# Altium schematic sheet A3010_Adelaide_Keyboard.SchDoc: ARM2 to ARM3 Adapter
size A3; DocumentNumber: 1; SheetNumber: 2; SheetTotal: 5
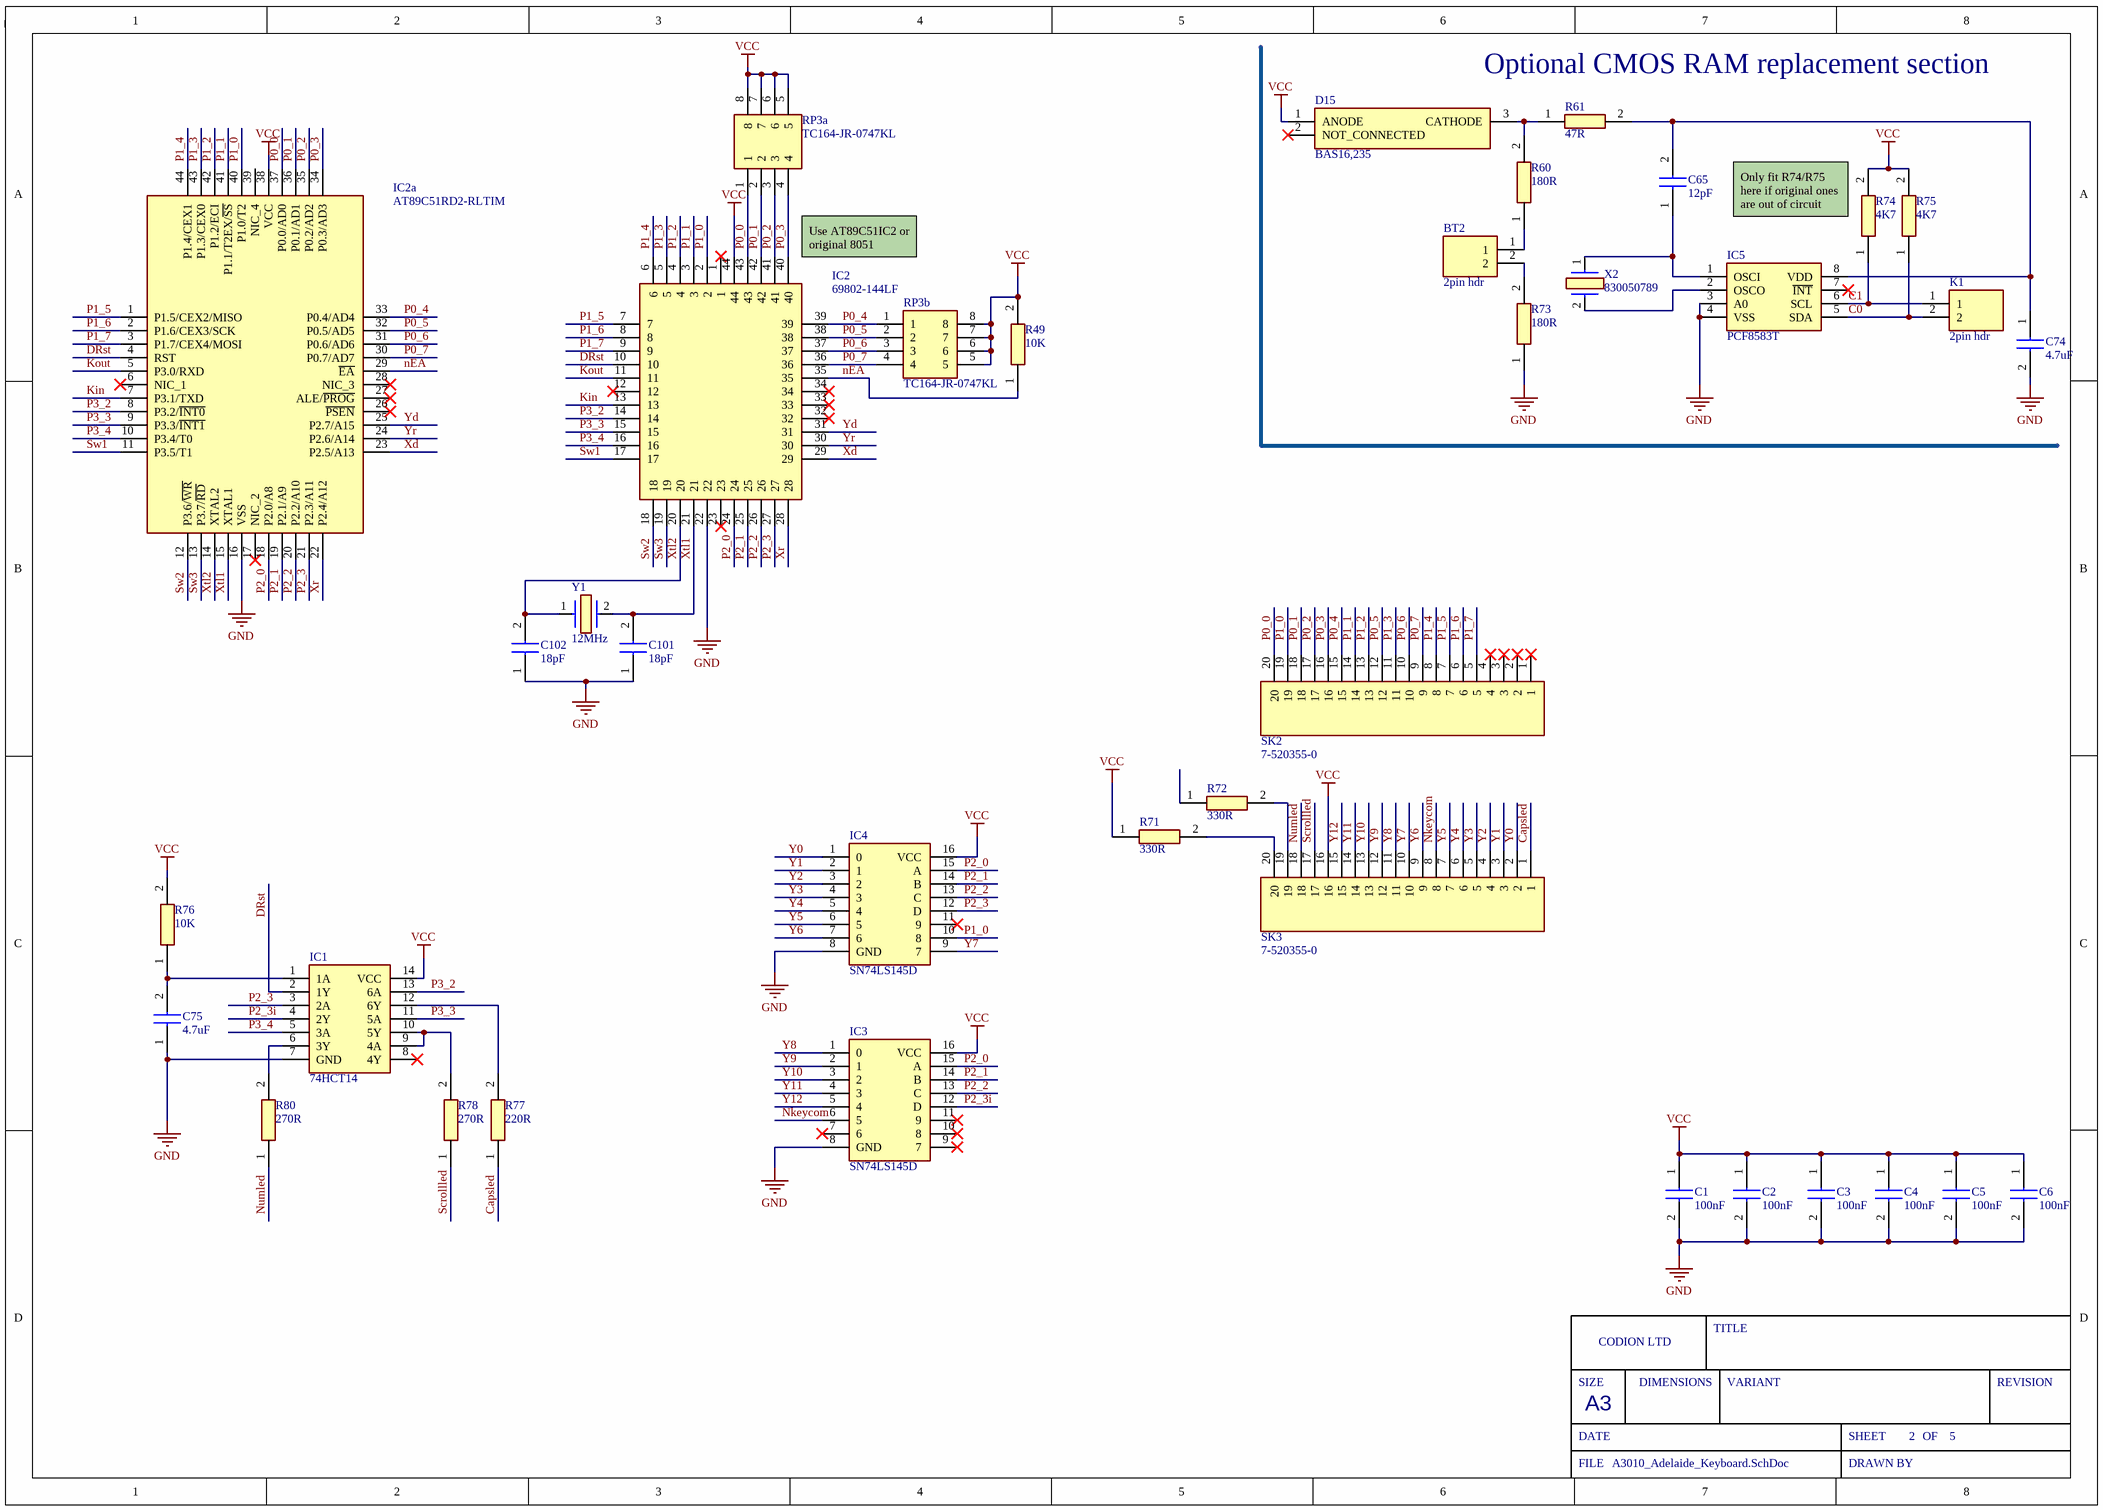
[diagram p0: A3010_Adelaide_Keyboard.SchDoc]

## Parts
BT2  2pin hdr  [10129378902002BLF]
C1  100nF  [0805cap]
C2  100nF  [0805cap]
C3  100nF  [0805cap]
C4  100nF  [0805cap]
C5  100nF  [0805cap]
C6  100nF  [0805cap]
C65  12pF  [CAPC1608X90N]
C74  4.7uF  [0805cap]
C75  4.7uF  [0805cap]
C101  18pF  [CAPC1608X87N]
C102  18pF  [CAPC1608X87N]
D15  BAS16,235  [SOT95P230X110-3N]
IC1  74HCT14  [SOIC127P600X175-14N]
IC2  69802-144LF  [69802144LF]
IC2a  AT89C51RD2-RLTIM  [QFP80P1200X1200X160-44N]
IC3  SN74LS145D  [SOIC127P600X175-16N]
IC4  SN74LS145D  [SOIC127P600X175-16N]
IC5  PCF8583T  [SOIC127P1032X265-8N]
K1  2pin hdr  [10129378902002BLF]
R49  10K  [RESC1005X40N]
R60  180R  [RESC1005X40N]
R61  47R  [RESC1005X40N]
R71  330R  [RESC1005X40N]
R72  330R  [RESC1005X40N]
R73  180R  [RESC1005X40N]
R74  4K7  [RESC1005X40N]
R75  4K7  [RESC1005X40N]
R76  10K  [RESC1005X40N]
R77  220R  [RESC1005X40N]
R78  270R  [RESC1005X40N]
R80  270R  [RESC1005X40N]
RP3a  TC164-JR-0747KL  [TC164JR0747KL]
RP3b  TC164-JR-0747KL  [TC164JR0747KL]
SK2  7-520355-0  [75203550]
SK3  7-520355-0  [75203550]
X2  830050789  [830050789]
Y1  12MHz  [ABM3]

## Nets
GND: C1.2 C2.2 C3.2 C4.2 C5.2 C6.2 C74.2 C75.1 C101.1 C102.1 IC1.7(GND) IC2.22 IC2a.16(VSS) IC3.8(GND) IC4.8(GND) IC5.3(A0) IC5.4(VSS) R73.1
VCC: C1.1 C2.1 C3.1 C4.1 C5.1 C6.1 D15.1(ANODE) IC1.14(VCC) IC2.44 IC2a.38(VCC) IC3.16(VCC) IC4.16(VCC) R49.2 R71.1 R74.2 R75.2 R76.2 RP3a.5 RP3a.6 RP3a.7 RP3a.8 RP3b.5 RP3b.6 RP3b.7 RP3b.8 SK3.16
C0: IC5.5(SDA) K1.2 R75.1
C1: IC5.6(SCL) K1.1 R74.1
Capsled: R77.1 SK3.1
DRst: IC1.2(1Y) IC2.10 IC2a.4(RST)
Kin: IC2.13 IC2a.7(P3.1/TXD)
Kout: IC2.11 IC2a.5(P3.0/RXD)
nEA: IC2.35 IC2a.29(~{EA}) R49.1
Nkeycom: IC3.6(5) SK3.8
Numled: R80.1 SK3.18
P0_0: IC2.43 IC2a.37(P0.0/AD0) RP3a.1 SK2.20
P0_1: IC2.42 IC2a.36(P0.1/AD1) RP3a.2 SK2.18
P0_2: IC2.41 IC2a.35(P0.2/AD2) RP3a.3 SK2.17
P0_3: IC2.40 IC2a.34(P0.3/AD3) RP3a.4 SK2.16
P0_4: IC2.39 IC2a.33(P0.4/AD4) RP3b.1 SK2.15
P0_5: IC2.38 IC2a.32(P0.5/AD5) RP3b.2 SK2.12
P0_6: IC2.37 IC2a.31(P0.6/AD6) RP3b.3 SK2.10
P0_7: IC2.36 IC2a.30(P0.7/AD7) RP3b.4 SK2.9
P1_0: IC2.2 IC2a.40(P1.0/T2) IC4.10(8) SK2.19
P1_1: IC2.3 IC2a.41(P1.1/T2EX/~{SS}) SK2.14
P1_2: IC2.4 IC2a.42(P1.2/ECI) SK2.13
P1_3: IC2.5 IC2a.43(P1.3/CEX0) SK2.11
P1_4: IC2.6 IC2a.44(P1.4/CEX1) SK2.8
P1_5: IC2.7 IC2a.1(P1.5/CEX2/MISO) SK2.7
P1_6: IC2.8 IC2a.2(P1.6/CEX3/SCK) SK2.6
P1_7: IC2.9 IC2a.3(P1.7/CEX4/MOSI) SK2.5
P2_0: IC2.24 IC2a.18(P2.0/A8) IC3.15(A) IC4.15(A)
P2_1: IC2.25 IC2a.19(P2.1/A9) IC3.14(B) IC4.14(B)
P2_2: IC2.26 IC2a.20(P2.2/A10) IC3.13(C) IC4.13(C)
P2_3: IC1.3(2A) IC2.27 IC2a.21(P2.3/A11) IC4.12(D)
P2_3i: IC1.4(2Y) IC3.12(D)
P3_2: IC1.13(6A) IC2.14 IC2a.8(P3.2/~{INT0})
P3_3: IC1.11(5A) IC2.15 IC2a.9(P3.3/~{INT1})
P3_4: IC1.5(3A) IC2.16 IC2a.10(P3.4/T0)
Scrollled: R78.1 SK3.17
Sw1: IC2.17 IC2a.11(P3.5/T1)
Sw2: IC2.18 IC2a.12(P3.6/~{WR})
Sw3: IC2.19 IC2a.13(P3.7/~{RD})
Xd: IC2.29 IC2a.23(P2.5/A13)
Xr: IC2.28 IC2a.22(P2.4/A12)
Xtl1: C101.2 IC2.21 IC2a.15(XTAL1) Y1.2
Xtl2: C102.2 IC2.20 IC2a.14(XTAL2) Y1.1
Y0: IC4.1(0) SK3.2
Y1: IC4.2(1) SK3.3
Y2: IC4.3(2) SK3.4
Y3: IC4.4(3) SK3.5
Y4: IC4.5(4) SK3.6
Y5: IC4.6(5) SK3.7
Y6: IC4.7(6) SK3.9
Y7: IC4.9(7) SK3.10
Y8: IC3.1(0) SK3.11
Y9: IC3.2(1) SK3.12
Y10: IC3.3(2) SK3.13
Y11: IC3.4(3) SK3.14
Y12: IC3.5(4) SK3.15
Yd: IC2.31 IC2a.25(P2.7/A15)
Yr: IC2.30 IC2a.24(P2.6/A14)
NetBT2_1: BT2.1 R60.1
NetBT2_2: BT2.2 R73.2
NetC65_1: C65.1 IC5.1(OSCI) X2.1
NetC65_2: C65.2 C74.1 IC5.8(VDD) R61.2
NetC75_2: C75.2 IC1.1(1A) R76.1
NetD15_3: D15.3(CATHODE) R60.2 R61.1
NetIC1_6: IC1.6(3Y) R80.2
NetIC1_9: IC1.9(4A) IC1.10(5Y) R78.2
NetIC1_12: IC1.12(6Y) R77.2
NetIC5_2: IC5.2(OSCO) X2.2
NetR71_2: R71.2 SK3.20
NetR72_2: R72.2 SK3.19

Not connected (* = marked no-connect by the designer): D15 2(NOT_CONNECTED)*; IC1 8(4Y)*; IC2 1* 12* 23* 32* 33* 34*; IC2a 6(NIC_1)* 17(NIC_2)* 26(~{PSEN})* 27(ALE/~{PROG})* 28(NIC_3)* 39(NIC_4); IC3 7(6)* 9(7)* 10(8)* 11(9)*; IC4 11(9)*; IC5 7(~{INT})*; R72 1; SK2 1* 2* 3* 4*

## Notes on the sheet
- Optional CMOS RAM replacement section
- (near R74) Only fit R74/R75 here if original ones are out of circuit
- (near IC2) Use AT89C51IC2 or original 8051
- SIZE
- CODION LTD
- DIMENSIONS
- TITLE
- VARIANT
- REVISION
- DATE
- A3
- SHEET
- OF
- FILE
- DRAWN BY

## Library data of the parts
BT2 K1 = 10129378-902002BLF: Connector; Manufacturer_Name: Amphenol Communications Solutions; Datasheet Link: https://cdn.amphenol-cs.com/media/wysiwyg/files/drawing/10129378.pdf; Height: 8.58mm; Manufacturer_Part_Number: 10129378-902002BLF
C1-C6 = 100nF0805: Capacitor; Manufacturer_Name: TDK; Manufacturer_Part_Number: C2012X7R1H104K125AM; Datasheet Link: https://product.tdk.com/info/en/catalog/datasheets/mlcc_commercial_midvoltage_en.pdf; Height: 1.45mm; Mouser Part Number: 810-C2012X7R1H104KT5; Mouser Price/Stock: https://www.mouser.com/Search/Refine.aspx?Keyword=810-C2012X7R1H104KT5; Arrow Part Number: C2012X7R1H104K125AM; Arrow Price/Stock: https://www.arrow.com/en/products/c2012x7r1h104k125am/tdk; LCSC Part #: C111492
C65 = CL10C120JB8NNNC: Capacitor; Manufacturer_Name: SAMSUNG; Datasheet Link: http://uk.rs-online.com/web/p/products/7664995; Height: 0.9mm; Manufacturer_Part_Number: CL10C120JB8NNNC; Mouser Part Number: N/A; Mouser Price/Stock: https://www.mouser.co.uk/ProductDetail/Samsung-Electro-Mechanics/CL10C120JB8NNNC?qs=349EhDEZ59q%252BsXw6lhqGjQ%3D%3D; Arrow Part Number: CL10C120JB8NNNC; Arrow Price/Stock: https://www.arrow.com/en/products/cl10c120jb8nnnc/samsung-electro-mechanics
C74 C75 = 4u7F0805: Capacitor; ManuPart: KGM21AR51C475MU
C101 C102 = C0603C180F5GACTU: Capacitor; Manufacturer_Name: KEMET; Datasheet Link: https://content.kemet.com/datasheets/KEM_C1003_C0G_SMD.pdf; Height: 0.87mm; Manufacturer_Part_Number: C0603C180F5GACTU; Mouser Part Number: 80-C0603C180F5G; Mouser Price/Stock: https://www.mouser.co.uk/ProductDetail/KEMET/C0603C180F5GACTU?qs=nRD1PKnFC2GPi%2FOLc6pETA%3D%3D; Arrow Part Number: C0603C180F5GACTU; Arrow Price/Stock: https://www.arrow.com/en/products/c0603c180f5gactu/kemet-corporation?region=nac
D15 = BAS16,235: Diode; Manufacturer_Name: Nexperia; Datasheet Link: http://www.nxp.com/documents/data_sheet/BAS16_SER.pdf; Height: 1.1mm; Manufacturer_Part_Number: BAS16,235; Mouser Part Number: 771-BAS16235; Mouser Price/Stock: https://www.mouser.co.uk/ProductDetail/Nexperia/BAS16235?qs=me8TqzrmIYXqqOYz5furtQ%3D%3D; Arrow Part Number: BAS16,235; Arrow Price/Stock: https://www.arrow.com/en/products/bas16235/nexperia?utm_currency=USD&region=europe
IC1 = 74HCT14D_BJ_: Integrated Circuit; Manufacturer_Name: Toshiba; Manufacturer_Part_Number: 74HCT14D(BJ); Datasheet Link: https://www.arrow.com/en/products/74hct14d-bj/toshiba?region=nac; Height: 1.75mm; Mouser Part Number: 757-74HCT14DBJ; Mouser Price/Stock: https://www.mouser.co.uk/ProductDetail/Toshiba/74HCT14DBJ?qs=lQAVKuKFhkJBaNJWtuyKQw%3D%3D; Arrow Part Number: 74HCT14D(BJ); Arrow Price/Stock: https://www.arrow.com/en/products/74hct14d-bj/toshiba?region=nac
IC2 = 69802-144LF: Connector; Manufacturer_Name: Amphenol Communications Solutions; Datasheet Link: https://cdn.amphenol-cs.com/media/wysiwyg/files/documentation/datasheet/boardwiretoboard/bwtb_ic_plcc.pdf; Height: 4.62mm; Manufacturer_Part_Number: 69802-144LF; Mouser Part Number: 649-69802-144LF; Mouser Price/Stock: https://www.mouser.co.uk/ProductDetail/Amphenol-FCI/69802-144LF?qs=kJUkXSjFC7wFmVr2EYK5aQ%3D%3D; Arrow Part Number: 69802-144LF; Arrow Price/Stock: https://www.arrow.com/en/products/69802-144lf/amphenol-fci?region=europe
IC2a = AT89C51RD2-RLTIM: Integrated Circuit; Manufacturer_Name: Microchip; Datasheet Link: http://www.mouser.com/datasheet/2/268/doc4257-1180836.pdf; Height: 1.6mm; Manufacturer_Part_Number: AT89C51RD2-RLTIM; Mouser Part Number: N/A; Mouser Price/Stock: https://www.mouser.com/Search/Refine.aspx?Keyword=N%2FA
IC3 IC4 = SN74LS145D: Integrated Circuit; Manufacturer_Name: Texas Instruments; Datasheet Link: http://www.ti.com/lit/gpn/SN74LS145; Height: 1.75mm; Manufacturer_Part_Number: SN74LS145D; Mouser Part Number: 595-SN74LS145D; Mouser Price/Stock: https://www.mouser.co.uk/ProductDetail/Texas-Instruments/SN74LS145D?qs=OorDGPQ79Eplw%252BzdCZy7wQ%3D%3D; Arrow Part Number: SN74LS145D; Arrow Price/Stock: https://www.arrow.com/en/products/sn74ls145d/texas-instruments?region=nac
IC5 = PCF8583T_5,518: Integrated Circuit; Manufacturer_Name: NXP; Manufacturer_Part_Number: PCF8583T/5,518; Datasheet Link: http://www.nxp.com/docs/en/data-sheet/PCF8583.pdf; Height: 2.65mm; Mouser Part Number: 771-PCF8583TD-T; Mouser Price/Stock: https://www.mouser.co.uk/ProductDetail/NXP-Semiconductors/PCF8583T-5518?qs=LOCUfHb8d9vGQfXHemzR2A%3D%3D; Arrow Part Number: PCF8583T/5,518; Arrow Price/Stock: https://www.arrow.com/en/products/pcf8583t5518/nxp-semiconductors?region=nac
R49 R76 = CRCW040210K0FKEDHP: Resistor; Manufacturer_Name: Vishay; Datasheet Link: http://www.vishay.com/docs/20035/dcrcwe3.pdf; Height: 0.4mm; Manufacturer_Part_Number: CRCW040210K0FKEDHP; Mouser Part Number: 71-CRCW040210K0FKEDH; Mouser Price/Stock: https://www.mouser.co.uk/ProductDetail/Vishay-Dale/CRCW040210K0FKEDHP?qs=FlFvgi4rxBxmIiaeyFjrkA%3D%3D; Arrow Part Number: CRCW040210K0FKEDHP; Arrow Price/Stock: https://www.arrow.com/en/products/crcw040210k0fkedhp/vishay?region=nac; LCSC Part #: C71617
R60 R73 = RC0402JR-07_180RL: Resistor; Manufacturer_Name: KEMET; Manufacturer_Part_Number: RC0402JR-07 180RL; Datasheet Link: https://www.arrow.com/en/products/rc0402jr-07180rl/yageo; Height: 0.4mm; Arrow Part Number: RC0402JR-07 180RL; Arrow Price/Stock: https://www.arrow.com/en/products/rc0402jr-07180rl/yageo
R61 = RC0402FR-07_47RL: Resistor; Manufacturer_Name: KEMET; Manufacturer_Part_Number: RC0402FR-07 47RL; Datasheet Link: http://www.yageo.com/documents/recent/PYu-RC0402_51_RoHS_L_6_r.pdf; Height: 0.4mm; Arrow Part Number: RC0402FR-07 47RL; Arrow Price/Stock: https://www.arrow.com/en/products/rc0402fr-0747rl/yageo
R71 R72 = RC0402FR-07330RL: Resistor; Manufacturer_Name: KEMET; Datasheet Link: http://www.yageo.com/documents/recent/PYu-RC0402_51_RoHS_L_6_r.pdf; Height: 0.4mm; Manufacturer_Part_Number: RC0402FR-07330RL; Mouser Part Number: 603-RC0402FR-07330RL; Mouser Price/Stock: https://www.mouser.co.uk/ProductDetail/Yageo/RC0402FR-07330RL?qs=V1yeUXFNrkngRWHRQxns%2Fg%3D%3D; Arrow Part Number: RC0402FR-07330RL; Arrow Price/Stock: https://www.arrow.com/en/products/rc0402fr-07330rl/yageo
R74 R75 = RC0402FR-07_4K7L: Resistor; Manufacturer_Name: KEMET; Manufacturer_Part_Number: RC0402FR-07 4K7L; Datasheet Link: http://www.yageo.com/documents/recent/PYu-RC0402_51_RoHS_L_6_r.pdf; Height: 0.4mm; Arrow Part Number: RC0402FR-07 4K7L; Arrow Price/Stock: https://www.arrow.com/en/products/rc0402fr-074k7l/yageo?region=nac
R77 = RC0402FR-07220RL: Resistor; Manufacturer_Name: KEMET; Datasheet Link: https://datasheet.datasheetarchive.com/originals/distributors/Datasheets_SAMA/902f9e387b938f871d31120f5fc1d65e.pdf; Height: 0.4mm; Manufacturer_Part_Number: RC0402FR-07220RL; Mouser Part Number: 603-RC0402FR-07220RL; Mouser Price/Stock: https://www.mouser.co.uk/ProductDetail/YAGEO/RC0402FR-07220RL?qs=UOUeRUa%252B8Wkw9iNOZEwgHw%3D%3D; Arrow Part Number: RC0402FR-07220RL; Arrow Price/Stock: https://www.arrow.com/en/products/rc0402fr-07220rl/yageo?region=nac
R78 R80 = RC0402FR-07270RL: Resistor; Manufacturer_Name: KEMET; Datasheet Link: http://www.yageo.com/documents/recent/PYu-RC0402_51_RoHS_L_6_r.pdf; Height: 0.4mm; Manufacturer_Part_Number: RC0402FR-07270RL; Mouser Part Number: 603-RC0402FR-07270RL; Mouser Price/Stock: https://www.mouser.co.uk/ProductDetail/Yageo/RC0402FR-07270RL?qs=beCmh%2FXShNd6fsxAzpS%2Fyw%3D%3D; Arrow Part Number: RC0402FR-07270RL; Arrow Price/Stock: https://www.arrow.com/en/products/rc0402fr-07270rl/yageo
RP3a RP3b = TC164-JR-0747KL: Resistor Network; Manufacturer_Name: YAGEO; Datasheet Link: https://www.yageo.com/upload/media/product/productsearch/datasheet/rchip/PYu-YC_TC_group_51_RoHS_L_9.pdf; Height: 0.7mm; Manufacturer_Part_Number: TC164-JR-0747KL
SK2 SK3 = 7-520355-0: Connector; Manufacturer_Name: TE Connectivity; Datasheet Link: https://www.te.com/commerce/DocumentDelivery/DDEController?Action=srchrtrv&DocNm=520355&DocType=Customer+Drawing&DocLang=English&PartCntxt=7-520355-0&DocFormat=pdf; Height: 7.31mm; Manufacturer_Part_Number: 7-520355-0; Mouser Part Number: 571-7-520355-0; Mouser Price/Stock: https://www.mouser.co.uk/ProductDetail/TE-Connectivity/7-520355-0?qs=g4ENe7ujGXUMgeVWxz5Gqg%3D%3D
X2 = 830050789: Crystal or Oscillator; Manufacturer_Name: Wurth Elektronik; Datasheet Link: https://www.we-online.com/catalog/datasheet/830050789.pdf; Height: 0.6mm; Manufacturer_Part_Number: 830050789; Mouser Part Number: 710-830050789; Mouser Price/Stock: https://www.mouser.co.uk/ProductDetail/Wurth-Elektronik/830050789?qs=2WXlatMagcG%2Fhb4pC63Fuw%3D%3D
Y1 = ABM3-12.000MHZ-D2Y-T: Crystal or Oscillator; Manufacturer_Name: ABRACON; Datasheet Link: https://abracon.com/Resonators/abm3.pdf; Height: 1.3mm; Manufacturer_Part_Number: ABM3-12.000MHZ-D2Y-T; Mouser Part Number: 815-ABM3-12-D2Y-T; Mouser Price/Stock: https://www.mouser.co.uk/ProductDetail/ABRACON/ABM3-12.000MHZ-D2Y-T?qs=ihRgKfnEsN4a%252Bhdo6LkcSg%3D%3D; Arrow Part Number: ABM3-12.000MHZ-D2Y-T; Arrow Price/Stock: https://www.arrow.com/en/products/abm3-12.000mhz-d2y-t/abracon?region=nac